# EAGLE design DisplayStick (EAGLE 7.4.0)
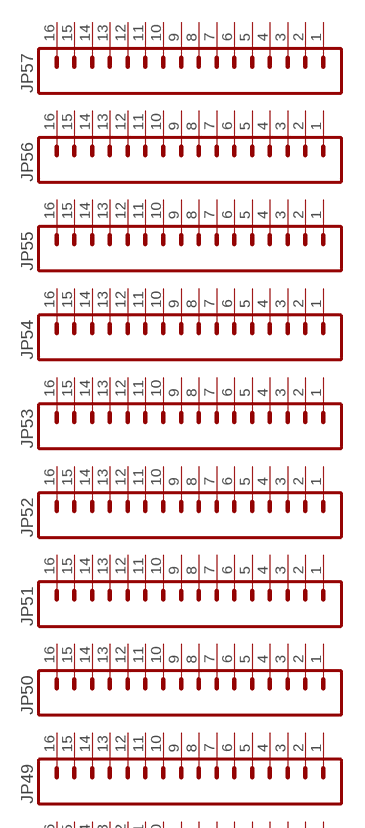
[diagram p0: schematic, sheet 1, part 1 of 2]
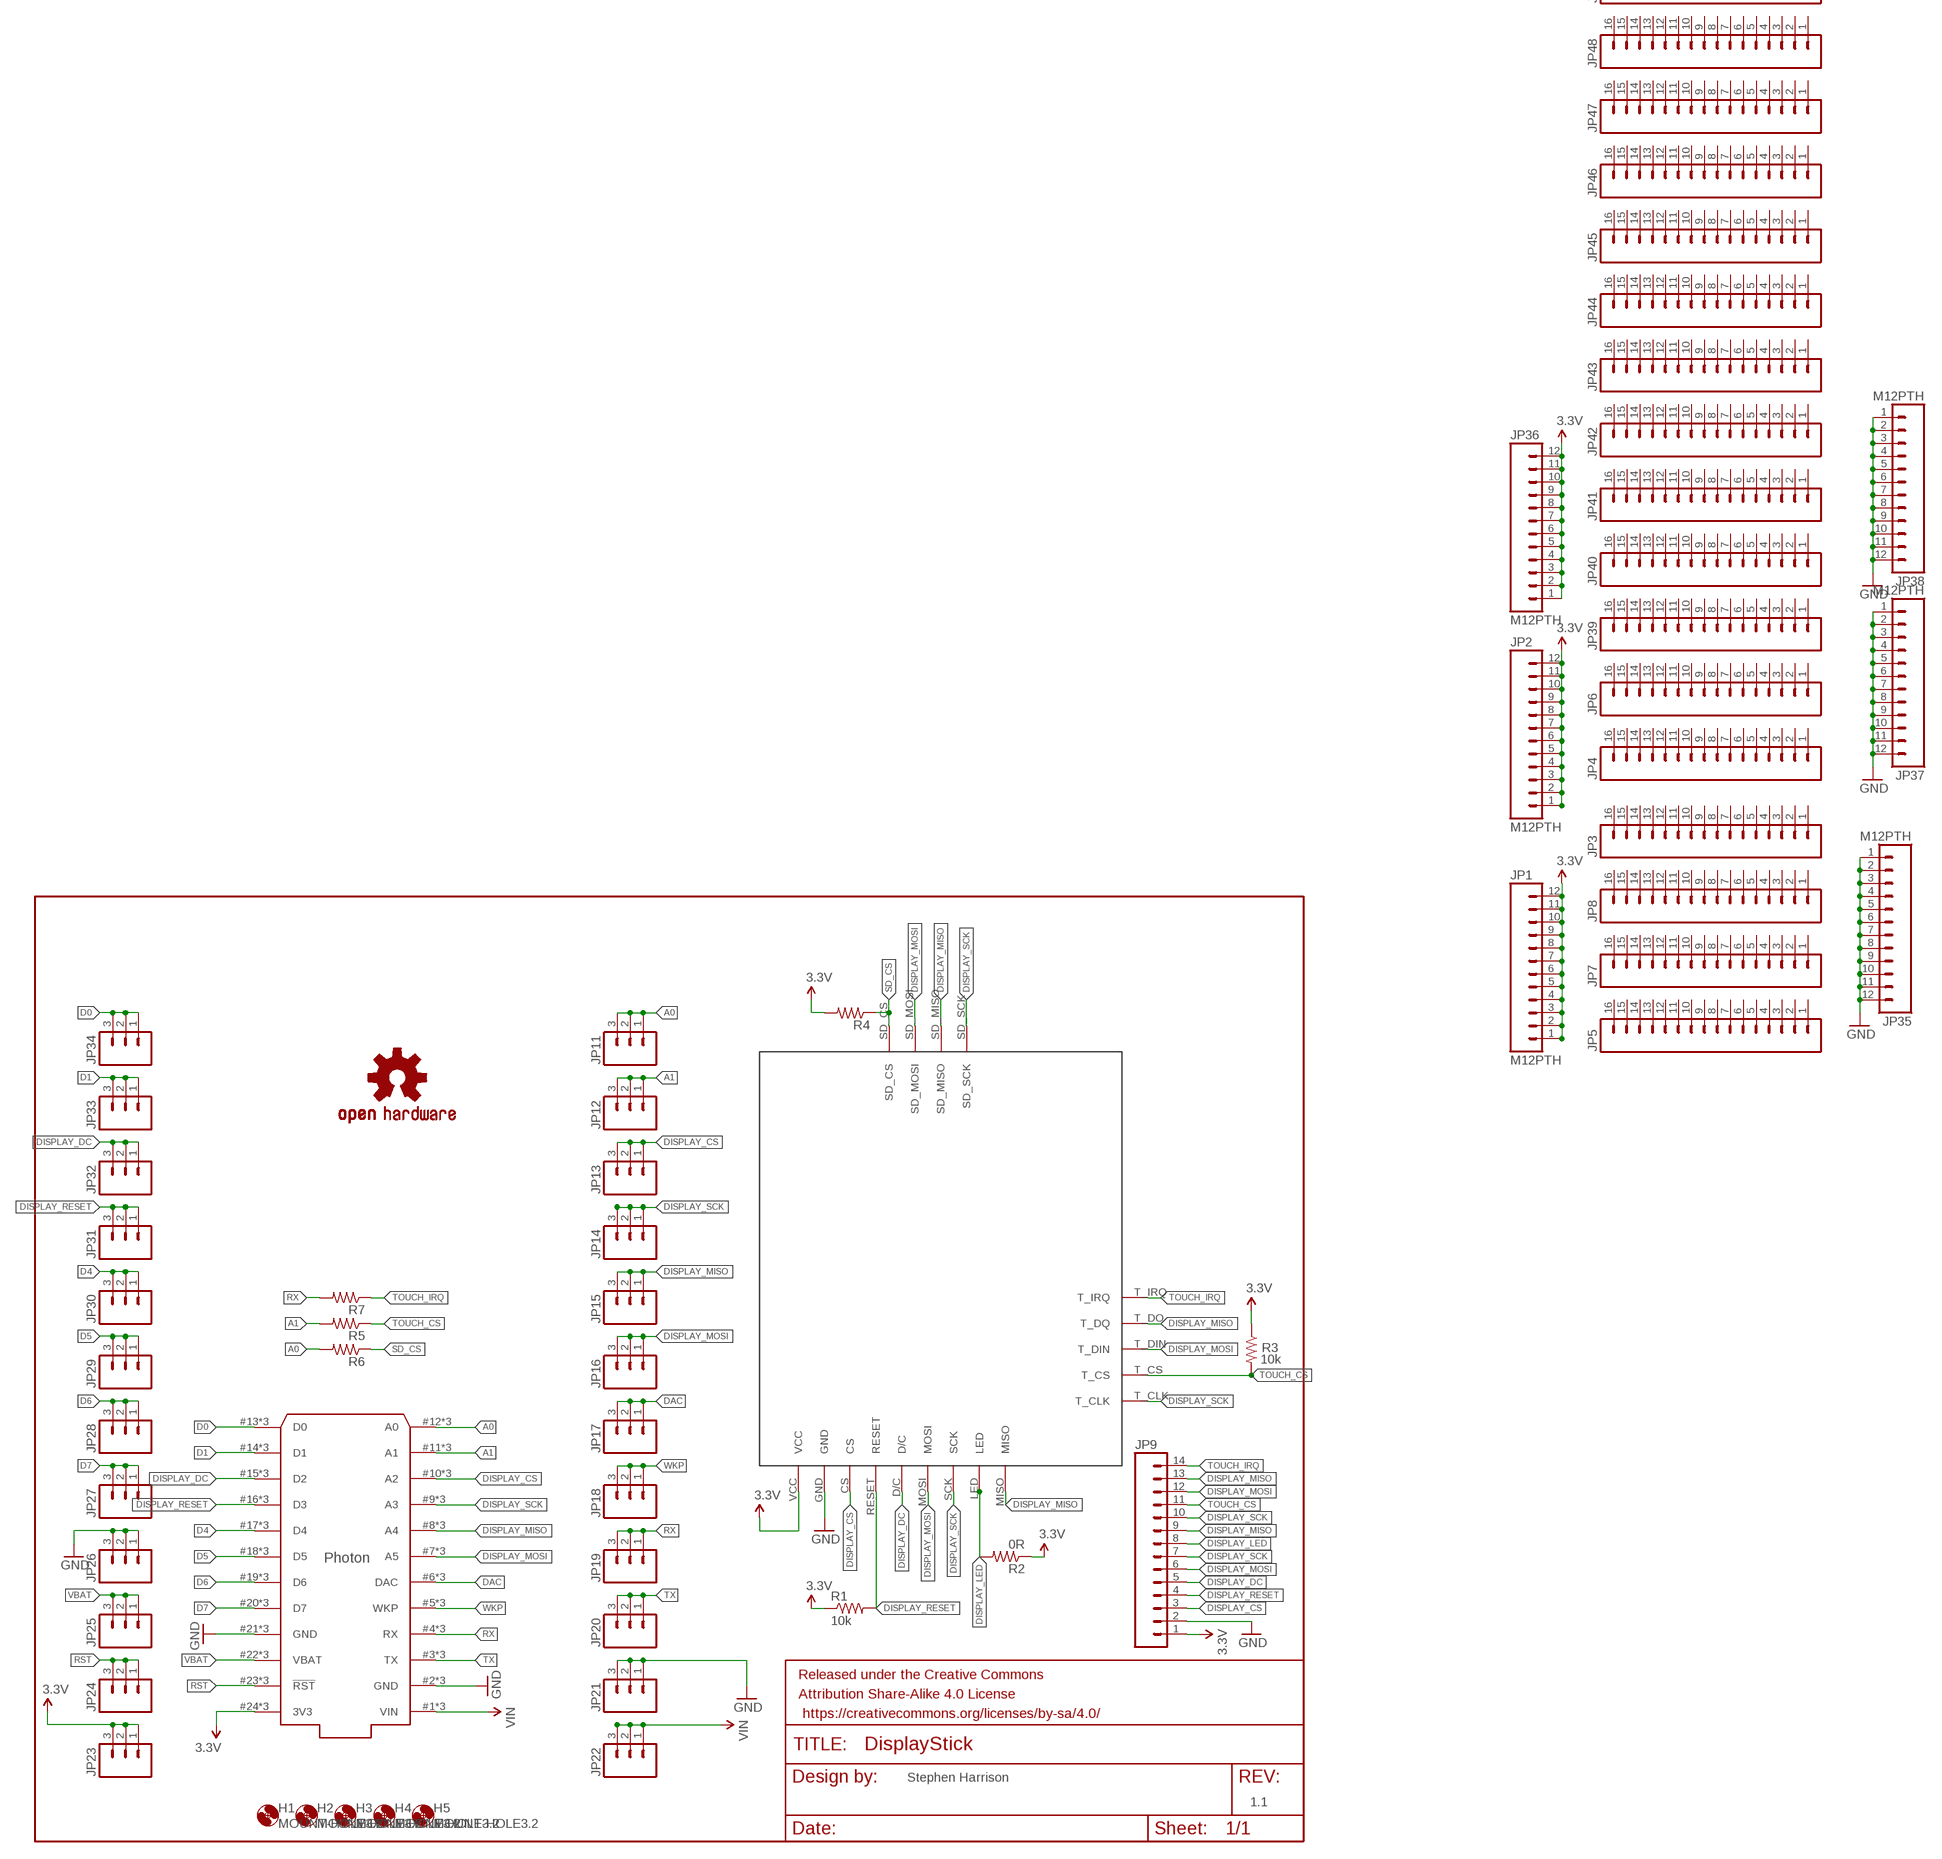
[diagram p1: schematic, sheet 1, part 2 of 2]

## Parts
FRAME1  FRAME-LETTER  [CREATIVE_COMMONS]
H1  MOUNT-HOLE3.2  [3,2]
H2  MOUNT-HOLE3.2  [3,2]
H3  MOUNT-HOLE3.2  [3,2]
H4  MOUNT-HOLE3.2  [3,2]
H5  MOUNT-HOLE3.2  [3,2]
JP1  M12PTH  [1X12-SMALL-PADS]
JP2  M12PTH  [1X12-SMALL-PADS]
JP3  M161X16_NO_SILK  [1X16_NO_SILK]
JP4  M161X16_NO_SILK  [1X16_NO_SILK]
JP5  M161X16_NO_SILK  [1X16_NO_SILK]
JP6  M161X16_NO_SILK  [1X16_NO_SILK]
JP7  M161X16_NO_SILK  [1X16_NO_SILK]
JP8  M161X16_NO_SILK  [1X16_NO_SILK]
JP9  M14  [1X14]
JP11  M03PTH  [1X03]
JP12  M03PTH  [1X03]
JP13  M03PTH  [1X03]
JP14  M03PTH  [1X03]
JP15  M03PTH  [1X03]
JP16  M03PTH  [1X03]
JP17  M03PTH  [1X03]
JP18  M03PTH  [1X03]
JP19  M03PTH  [1X03]
JP20  M03PTH  [1X03]
JP21  M03PTH  [1X03]
JP22  M03PTH  [1X03]
JP23  M03PTH  [1X03]
JP24  M03PTH  [1X03]
JP25  M03PTH  [1X03]
JP26  M03PTH  [1X03]
JP27  M03PTH  [1X03]
JP28  M03PTH  [1X03]
JP29  M03PTH  [1X03]
JP30  M03PTH  [1X03]
JP31  M03PTH  [1X03]
JP32  M03PTH  [1X03]
JP33  M03PTH  [1X03]
JP34  M03PTH  [1X03]
JP35  M12PTH  [1X12-SMALL-PADS]
JP36  M12PTH  [1X12-SMALL-PADS]
JP37  M12PTH  [1X12-SMALL-PADS]
JP38  M12PTH  [1X12-SMALL-PADS]
JP39  M161X16_NO_SILK  [1X16_NO_SILK]
JP40  M161X16_NO_SILK  [1X16_NO_SILK]
JP41  M161X16_NO_SILK  [1X16_NO_SILK]
JP42  M161X16_NO_SILK  [1X16_NO_SILK]
JP43  M161X16_NO_SILK  [1X16_NO_SILK]
JP44  M161X16_NO_SILK  [1X16_NO_SILK]
JP45  M161X16_NO_SILK  [1X16_NO_SILK]
JP46  M161X16_NO_SILK  [1X16_NO_SILK]
JP47  M161X16_NO_SILK  [1X16_NO_SILK]
JP48  M161X16_NO_SILK  [1X16_NO_SILK]
JP49  M161X16_NO_SILK  [1X16_NO_SILK]
JP50  M161X16_NO_SILK  [1X16_NO_SILK]
JP51  M161X16_NO_SILK  [1X16_NO_SILK]
JP52  M161X16_NO_SILK  [1X16_NO_SILK]
JP53  M161X16_NO_SILK  [1X16_NO_SILK]
JP54  M161X16_NO_SILK  [1X16_NO_SILK]
JP55  M161X16_NO_SILK  [1X16_NO_SILK]
JP56  M161X16_NO_SILK  [1X16_NO_SILK]
JP57  M161X16_NO_SILK  [1X16_NO_SILK]
LOGO1  OSHW-LOGOL  [OSHW-LOGO-L]
R1  10k  RESISTOR1206  [1206]
R2  0R  RESISTOR1206  [1206]
R3  10k  RESISTOR1206  [1206]
R4  RESISTOR1206  [1206]
R5  RESISTOR1206  [1206]
R6  RESISTOR1206  [1206]
R7  RESISTOR1206  [1206]
U$1  TJCTM240  [TJCTM240]
U$3  PHOTON_WITH_STACKABLE_HEADERS  [PHOTON_STACKABLE]

## Nets
3.3V: JP1.1 JP1.2 JP1.3 JP1.4 JP1.5 JP1.6 JP1.7 JP1.8 JP1.9 JP1.10 JP1.11 JP1.12 JP2.1 JP2.2 JP2.3 JP2.4 JP2.5 JP2.6 JP2.7 JP2.8 JP2.9 JP2.10 JP2.11 JP2.12 JP9.1 JP23.1 JP23.2 JP23.3 JP36.1 JP36.2 JP36.3 JP36.4 JP36.5 JP36.6 JP36.7 JP36.8 JP36.9 JP36.10 JP36.11 JP36.12 R1.1 R2.1 R3.1 R4.2 U$1.VCC U$3.24(3V3) U$3.#24(3V3) U$3.@24(3V3)
A0: JP11.1 JP11.2 JP11.3 R6.2 U$3.12(A0) U$3.#12(A0) U$3.@12(A0)
A1: JP12.1 JP12.2 JP12.3 R5.2 U$3.11(A1) U$3.#11(A1) U$3.@11(A1)
D0: JP34.1 JP34.2 JP34.3 U$3.13(D0) U$3.#13(D0) U$3.@13(D0)
D1: JP33.1 JP33.2 JP33.3 U$3.14(D1) U$3.#14(D1) U$3.@14(D1)
D4: JP30.1 JP30.2 JP30.3 U$3.17(D4) U$3.#17(D4) U$3.@17(D4)
D5: JP29.1 JP29.2 JP29.3 U$3.18(D5) U$3.#18(D5) U$3.@18(D5)
D6: JP28.1 JP28.2 JP28.3 U$3.19(D6) U$3.#19(D6) U$3.@19(D6)
D7: JP27.1 JP27.2 JP27.3 U$3.20(D7) U$3.#20(D7) U$3.@20(D7)
DAC: JP17.1 JP17.2 JP17.3 U$3.6(DAC) U$3.#6(DAC) U$3.@6(DAC)
DISPLAY_CS: JP9.3 JP13.1 JP13.2 JP13.3 U$1.CS U$3.10(A2) U$3.#10(A2) U$3.@10(A2)
DISPLAY_DC: JP9.5 JP32.1 JP32.2 JP32.3 U$1.D/C U$3.15(D2) U$3.#15(D2) U$3.@15(D2)
DISPLAY_LED: JP9.8 R2.2 U$1.LED
DISPLAY_MISO: JP9.9 JP9.13 JP15.1 JP15.2 JP15.3 U$1.MISO U$1.SD_MISO U$1.T_DO(T_DQ) U$3.8(A4) U$3.#8(A4) U$3.@8(A4)
DISPLAY_MOSI: JP9.6 JP9.12 JP16.1 JP16.2 JP16.3 U$1.MOSI U$1.SD_MOSI U$1.T_DIN U$3.7(A5) U$3.#7(A5) U$3.@7(A5)
DISPLAY_RESET: JP9.4 JP31.1 JP31.2 JP31.3 R1.2 U$1.RESET U$3.16(D3) U$3.#16(D3) U$3.@16(D3)
DISPLAY_SCK: JP9.7 JP9.10 JP14.1 JP14.2 JP14.3 U$1.SCK U$1.SD_SCK U$1.T_CLK U$3.9(A3) U$3.#9(A3) U$3.@9(A3)
GND: JP9.2 JP21.1 JP21.2 JP21.3 JP26.1 JP26.2 JP26.3 JP35.1 JP35.2 JP35.3 JP35.4 JP35.5 JP35.6 JP35.7 JP35.8 JP35.9 JP35.10 JP35.11 JP35.12 JP37.1 JP37.2 JP37.3 JP37.4 JP37.5 JP37.6 JP37.7 JP37.8 JP37.9 JP37.10 JP37.11 JP37.12 JP38.1 JP38.2 JP38.3 JP38.4 JP38.5 JP38.6 JP38.7 JP38.8 JP38.9 JP38.10 JP38.11 JP38.12 U$1.GND U$3.2(GND) U$3.21(GND) U$3.#2(GND) U$3.#21(GND) U$3.@2(GND) U$3.@21(GND)
RST: JP24.1 JP24.2 JP24.3 U$3.23(!RST) U$3.#23(!RST) U$3.@23(!RST)
RX: JP19.1 JP19.2 JP19.3 R7.2 U$3.4(RX) U$3.#4(RX) U$3.@4(RX)
SD_CS: R4.1 R6.1 U$1.SD_CS
TOUCH_CS: JP9.11 R3.2 R5.1 U$1.T_CS
TOUCH_IRQ: JP9.14 R7.1 U$1.T_IRQ
TX: JP20.1 JP20.2 JP20.3 U$3.3(TX) U$3.#3(TX) U$3.@3(TX)
VBAT: JP25.1 JP25.2 JP25.3 U$3.22(VBAT) U$3.#22(VBAT) U$3.@22(VBAT)
VIN: JP22.1 JP22.2 JP22.3 U$3.1(VIN) U$3.#1(VIN) U$3.@1(VIN)
WKP: JP18.1 JP18.2 JP18.3 U$3.5(WKP) U$3.#5(WKP) U$3.@5(WKP)
Unconnected: JP3.1 JP3.2 JP3.3 JP3.4 JP3.5 JP3.6 JP3.7 JP3.8 JP3.9 JP3.10 JP3.11 JP3.12 JP3.13 JP3.14 JP3.15 JP3.16 JP4.1 JP4.2 JP4.3 JP4.4 JP4.5 JP4.6 JP4.7 JP4.8 JP4.9 JP4.10 JP4.11 JP4.12 JP4.13 JP4.14 JP4.15 JP4.16 JP5.1 JP5.2 JP5.3 JP5.4 JP5.5 JP5.6 JP5.7 JP5.8 JP5.9 JP5.10 JP5.11 JP5.12 JP5.13 JP5.14 JP5.15 JP5.16 JP6.1 JP6.2 JP6.3 JP6.4 JP6.5 JP6.6 JP6.7 JP6.8 JP6.9 JP6.10 JP6.11 JP6.12 JP6.13 JP6.14 JP6.15 JP6.16 JP7.1 JP7.2 JP7.3 JP7.4 JP7.5 JP7.6 JP7.7 JP7.8 JP7.9 JP7.10 JP7.11 JP7.12 JP7.13 JP7.14 JP7.15 JP7.16 JP8.1 JP8.2 JP8.3 JP8.4 JP8.5 JP8.6 JP8.7 JP8.8 JP8.9 JP8.10 JP8.11 JP8.12 JP8.13 JP8.14 JP8.15 JP8.16 JP39.1 JP39.2 JP39.3 JP39.4 JP39.5 JP39.6 JP39.7 JP39.8 JP39.9 JP39.10 JP39.11 JP39.12 JP39.13 JP39.14 JP39.15 JP39.16 JP40.1 JP40.2 JP40.3 JP40.4 JP40.5 JP40.6 JP40.7 JP40.8 JP40.9 JP40.10 JP40.11 JP40.12 JP40.13 JP40.14 JP40.15 JP40.16 JP41.1 JP41.2 JP41.3 JP41.4 JP41.5 JP41.6 JP41.7 JP41.8 JP41.9 JP41.10 JP41.11 JP41.12 JP41.13 JP41.14 JP41.15 JP41.16 JP42.1 JP42.2 JP42.3 JP42.4 JP42.5 JP42.6 JP42.7 JP42.8 JP42.9 JP42.10 JP42.11 JP42.12 JP42.13 JP42.14 JP42.15 JP42.16 JP43.1 JP43.2 JP43.3 JP43.4 JP43.5 JP43.6 JP43.7 JP43.8 JP43.9 JP43.10 JP43.11 JP43.12 JP43.13 JP43.14 JP43.15 JP43.16 JP44.1 JP44.2 JP44.3 JP44.4 JP44.5 JP44.6 JP44.7 JP44.8 JP44.9 JP44.10 JP44.11 JP44.12 JP44.13 JP44.14 JP44.15 JP44.16 JP45.1 JP45.2 JP45.3 JP45.4 JP45.5 JP45.6 JP45.7 JP45.8 JP45.9 JP45.10 JP45.11 JP45.12 JP45.13 JP45.14 JP45.15 JP45.16 JP46.1 JP46.2 JP46.3 JP46.4 JP46.5 JP46.6 JP46.7 JP46.8 JP46.9 JP46.10 JP46.11 JP46.12 JP46.13 JP46.14 JP46.15 JP46.16 JP47.1 JP47.2 JP47.3 JP47.4 JP47.5 JP47.6 JP47.7 JP47.8 JP47.9 JP47.10 JP47.11 JP47.12 JP47.13 JP47.14 JP47.15 JP47.16 JP48.1 JP48.2 JP48.3 JP48.4 JP48.5 JP48.6 JP48.7 JP48.8 JP48.9 JP48.10 JP48.11 JP48.12 JP48.13 JP48.14 JP48.15 JP48.16 JP49.1 JP49.2 JP49.3 JP49.4 JP49.5 JP49.6 JP49.7 JP49.8 JP49.9 JP49.10 JP49.11 JP49.12 JP49.13 JP49.14 JP49.15 JP49.16 JP50.1 JP50.2 JP50.3 JP50.4 JP50.5 JP50.6 JP50.7 JP50.8 JP50.9 JP50.10 JP50.11 JP50.12 JP50.13 JP50.14 JP50.15 JP50.16 JP51.1 JP51.2 JP51.3 JP51.4 JP51.5 JP51.6 JP51.7 JP51.8 JP51.9 JP51.10 JP51.11 JP51.12 JP51.13 JP51.14 JP51.15 JP51.16 JP52.1 JP52.2 JP52.3 JP52.4 JP52.5 JP52.6 JP52.7 JP52.8 JP52.9 JP52.10 JP52.11 JP52.12 JP52.13 JP52.14 JP52.15 JP52.16 JP53.1 JP53.2 JP53.3 JP53.4 JP53.5 JP53.6 JP53.7 JP53.8 JP53.9 JP53.10 JP53.11 JP53.12 JP53.13 JP53.14 JP53.15 JP53.16 JP54.1 JP54.2 JP54.3 JP54.4 JP54.5 JP54.6 JP54.7 JP54.8 JP54.9 JP54.10 JP54.11 JP54.12 JP54.13 JP54.14 JP54.15 JP54.16 JP55.1 JP55.2 JP55.3 JP55.4 JP55.5 JP55.6 JP55.7 JP55.8 JP55.9 JP55.10 JP55.11 JP55.12 JP55.13 JP55.14 JP55.15 JP55.16 JP56.1 JP56.2 JP56.3 JP56.4 JP56.5 JP56.6 JP56.7 JP56.8 JP56.9 JP56.10 JP56.11 JP56.12 JP56.13 JP56.14 JP56.15 JP56.16 JP57.1 JP57.2 JP57.3 JP57.4 JP57.5 JP57.6 JP57.7 JP57.8 JP57.9 JP57.10 JP57.11 JP57.12 JP57.13 JP57.14 JP57.15 JP57.16

## Notes on the sheet
- Stephen Harrison
- 1.1

## Library data of the parts
FRAME1 = SparkFun-Aesthetics:FRAME-LETTER: Schematic Frame Standard 8.5x11 US Letter frame
H1-H5 = holes:MOUNT-HOLE: MOUNTING HOLE with drill center marker
JP1 JP2 JP35-JP38 = Particle:M12: Header 12 Standard 12-pin 0.1" header. Use with straight break away headers (SKU : PRT-00116), right angle break away headers (PRT-00553), swiss pins (PRT-00743), machine pins (PRT-00117), and female headers (PRT-00115).
JP3-JP8 JP39-JP57 = SparkFun-Connectors:M16: 1x16 .1" header
JP9 = SparkFun-Connectors:M14: Header 14 Standard 14-pin 0.1" header. Use with straight break away headers (SKU : PRT-00116), right angle break away headers (PRT-00553), swiss pins (PRT-00743), machine pins (PRT-00117), and female headers (PRT-00115).
JP11-JP34 = SparkFun-Connectors:M03: Header 3 Standard 3-pin 0.1" header. Use with straight break away headers (SKU : PRT-00116), right angle break away headers (PRT-00553), swiss pins (PRT-00743), machine pins (PRT-00117), and female headers (PRT-00115). Molex polarized connector foot print use with SKU : PRT-08232 with associated crimp pins and housings.
LOGO1 = Spark:OSHW-LOGO: Open Source Hardware Logo This logo indicates the piece of hardware it is found on incorporates a OSHW license and/or adheres to the definition of open source hardware found here: http://freedomdefined.org/OSHW
R1-R7 = SparkFun-Resistors:RESISTOR: Resistor Basic schematic elements and footprints for 0603, 1206, and PTH resistors.
U$1 = 2.8InchTFT:TJCTM240: 2.8 tft spi 240*320 V1.1
U$3 = Particle:PHOTON

## Board
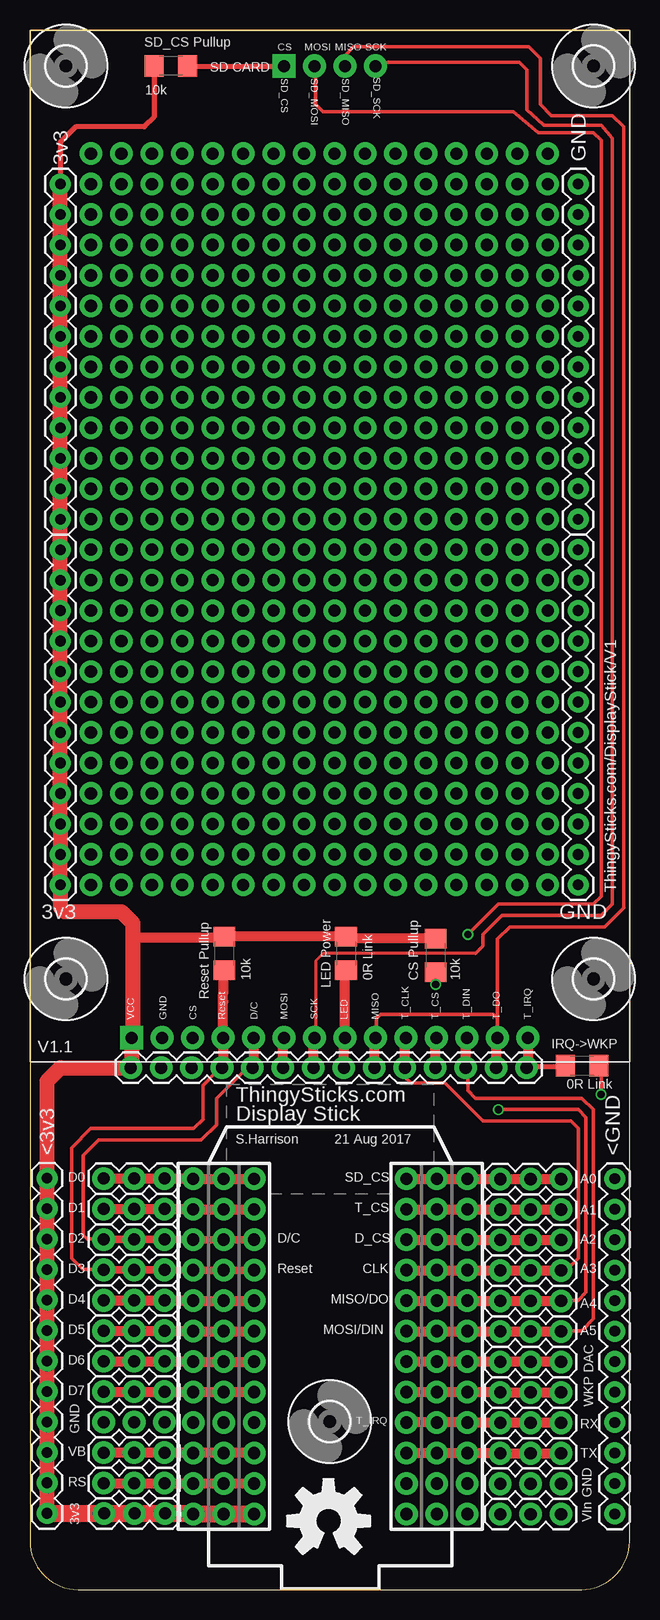
[diagram p2: board, top side]
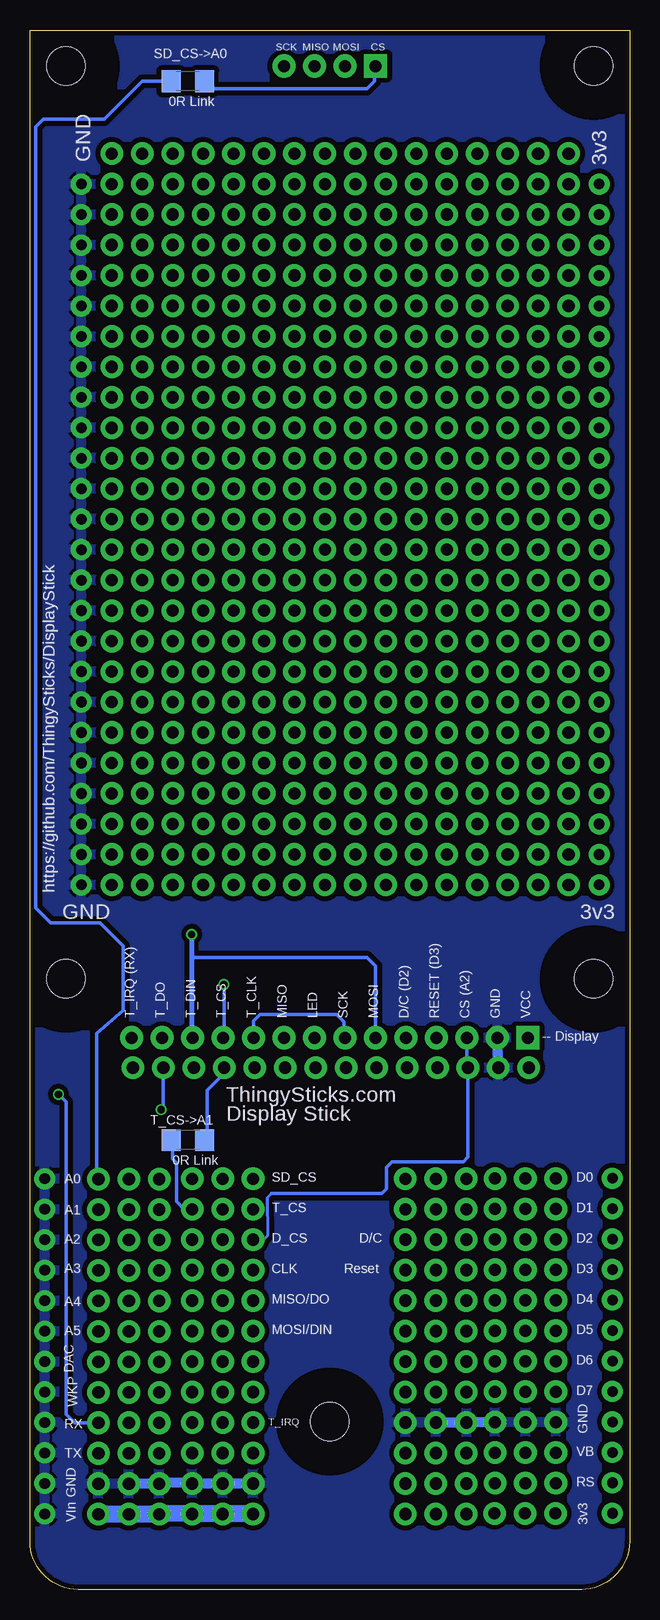
[diagram p3: board, bottom side, seen from below]

Size 50 x 130 mm. Coordinates in mm from the lower left corner, seen from the top.
Outline: 4,0 46,0 arc90 50,4 50,130 0,130 0,4 arc90 4,0
Copper layers (1*16): Top 0.035mm / dielectric 1.5mm / Bottom 0.035mm
Design rules "dirt_cheap_dirty_boards.v1": minimum track width 5mil, minimum drill 12mil, track to track 5mil, track to pad 5mil, pad to pad 5mil, via to via 5mil, smd to smd 0mil, copper to edge 10mil, drill to drill 10mil, minimum pad ring 10mil, minimum via ring 6mil, stop-mask expansion 2mil, vias tented up to drill 25mil, thermal gap 10mil
tRestrict: area 16.6,33 to 33.9,42.1
bRestrict: area 16.6,33 to 33.9,42.1

### Footprints (pad centres in the part's own frame; a part is rotated, then mirrored left to right if it is on the bottom)
3,2 = hole 3.2: 0,0
1X12-SMALL-PADS = drill 0.889 pad 1.753: 1 0,0; 2 2.54,0; 3 5.08,0; 4 7.62,0; 5 10.16,0; 6 12.7,0; 7 15.24,0; 8 17.78,0; 9 20.32,0; 10 22.86,0; 11 25.4,0; 12 27.94,0
1X16_NO_SILK = drill 1.016 pad 1.88: 1 0,0; 2 2.54,0; 3 5.08,0; 4 7.62,0; 5 10.16,0; 6 12.7,0; 7 15.24,0; 8 17.78,0; 9 20.32,0; 10 22.86,0; 11 25.4,0; 12 27.94,0; 13 30.48,0; 14 33.02,0; 15 35.56,0; 16 38.1,0
1X14 = drill 1.016 pad 1.88: 1 0,0; 2 2.54,0; 3 5.08,0; 4 7.62,0; 5 10.16,0; 6 12.7,0; 7 15.24,0; 8 17.78,0; 9 20.32,0; 10 22.86,0; 11 25.4,0; 12 27.94,0; 13 30.48,0; 14 33.02,0
1X03 = drill 1.016 pad 1.88: 1 0,0; 2 2.54,0; 3 5.08,0
1206 = smd 1.6 x 1.8: 1 -1.4,0; 2 1.4,0
TJCTM240 = drill 1 pad 1.93: CS 13.57,2; D/C 18.65,2; GND 11.03,2; LED 26.27,2; MISO 28.81,2; MOSI 21.19,2; RESET 16.11,2; SCK 23.73,2; SD_MISO 26.27,83; SD_MOSI 23.73,83; SD_SCK 28.81,83; T_CLK 31.35,2; T_CS 33.89,2; T_DIN 36.43,2; T_DO 38.97,2; T_IRQ 41.51,2 | drill 1 pad 1.93 square: SD_CS 21.19,83; VCC 8.49,2 | hole 3.2: 3,6.92; 47,6.92; 3,83; 47,83
PHOTON_STACKABLE = drill 1.016 pad 1.88: 1 1.27,32.258; 2 1.27,29.718; 3 1.27,27.178; 4 1.27,24.638; 5 1.27,22.098; 6 1.27,19.558; 7 1.27,17.018; 8 1.27,14.478; 9 1.27,11.938; 10 1.27,9.398; 11 1.27,6.858; 12 1.27,4.318; 13 19.05,4.318; 14 19.05,6.858; 15 19.05,9.398; 16 19.05,11.938; 17 19.05,14.478; 18 19.05,17.018; 19 19.05,19.558; 20 19.05,22.098; 21 19.05,24.638; 22 19.05,27.178; 23 19.05,29.718; 24 19.05,32.258; #1 3.81,32.258; #2 3.81,29.718; #3 3.81,27.178; #4 3.81,24.638; #5 3.81,22.098; #6 3.81,19.558; #7 3.81,17.018; #8 3.81,14.478; #9 3.81,11.938; #10 3.81,9.398; #11 3.81,6.858; #12 3.81,4.318; #13 21.59,4.318; #14 21.59,6.858; #15 21.59,9.398; #16 21.59,11.938; #17 21.59,14.478; #18 21.59,17.018; #19 21.59,19.558; #20 21.59,22.098; #21 21.59,24.638; #22 21.59,27.178; #23 21.59,29.718; #24 21.59,32.258; @1 -1.27,32.258; @2 -1.27,29.718; @3 -1.27,27.178; @4 -1.27,24.638; @5 -1.27,22.098; @6 -1.27,19.558; @7 -1.27,17.018; @8 -1.27,14.478; @9 -1.27,11.938; @10 -1.27,9.398; @11 -1.27,6.858; @12 -1.27,4.318; @13 16.51,4.318; @14 16.51,6.858; @15 16.51,9.398; @16 16.51,11.938; @17 16.51,14.478; @18 16.51,17.018; @19 16.51,19.558; @20 16.51,22.098; @21 16.51,24.638; @22 16.51,27.178; @23 16.51,29.718; @24 16.51,32.258

### Placement (x,y rotation side)
FRAME1  -5.71,-21.27 0 top  (outside the outline)
H1  25,14 0 top
H2  3,127 0 top
H3  47,127 0 top
H4  3,50.9 0 top
H5  47,50.9 0 top
JP1  1.42,6.35 90 top
JP2  2.54,58.74 90 top
JP3  5.08,66.36 0 top
JP4  5.08,68.9 0 top
JP5  5.08,58.74 0 top
JP6  5.08,71.44 0 top
JP7  5.08,61.28 0 top
JP8  5.08,63.82 0 top
JP9  8.4,43.5 0 top
JP11  39.22,34.21 0 top
JP12  39.22,31.67 0 top
JP13  39.22,29.13 0 top
JP14  39.22,26.59 0 top
JP15  39.22,24.05 0 top
JP16  39.22,21.51 0 top
JP17  39.22,18.97 0 top
JP18  39.22,16.43 0 top
JP19  39.22,13.89 0 top
JP20  39.22,11.35 0 top
JP21  39.22,8.81 0 top
JP22  39.22,6.27 0 top
JP23  6.18,6.35 0 top
JP24  6.15,8.86 0 top
JP25  6.15,11.4 0 top
JP26  6.15,13.94 0 top
JP27  6.15,16.48 0 top
JP28  6.15,19.02 0 top
JP29  6.15,21.56 0 top
JP30  6.15,24.1 0 top
JP31  6.15,26.64 0 top
JP32  6.15,29.18 0 top
JP33  6.15,31.72 0 top
JP34  6.15,34.26 0 top
JP35  48.77,6.3 90 top
JP36  2.54,89.22 90 top
JP37  45.72,58.74 90 top
JP38  45.72,89.22 90 top
JP39  5.08,73.98 0 top
JP40  5.08,76.52 0 top
JP41  5.08,79.06 0 top
JP42  5.08,81.6 0 top
JP43  5.08,84.14 0 top
JP44  5.08,86.68 0 top
JP45  5.08,89.22 0 top
JP46  5.08,91.76 0 top
JP47  5.08,94.3 0 top
JP48  5.08,96.84 0 top
JP49  5.08,99.38 0 top
JP50  5.08,101.92 0 top
JP51  5.08,104.46 0 top
JP52  5.08,107 0 top
JP53  5.08,109.54 0 top
JP54  5.08,112.08 0 top
JP55  5.08,114.62 0 top
JP56  5.08,117.16 0 top
JP57  5.08,119.7 0 top
LOGO1  24.9,5.71 0 top
R1  16.19,53.02 270 top
R2  26.35,53.02 270 top
R3  33.82,52.86 270 top
R4  11.75,127 180 top
R5  36.83,37.47 180 bottom
R6  36.83,125.73 180 bottom
R7  46.04,43.68 0 top
U$1  0,44 0 top
U$3  35.2,38.56 180 top

### Tracks (layer width: path | path; a pad name or v marks a point on that pad's centre or on a via)
3.3V
  Top 0.406: 26.5,54.26 R2.1 | JP36.12 2.54,120.65 3.81,121.92 9.53,121.92 10.35,122.74 R4.2
  Top 0.813: 8.49,43.59 JP9.1 | R3.1 26.5,54.26 | R2.1 R1.1 16.06,54.29 8.57,54.29
  Top 1.27: 8.49,43.59 U$1.VCC 8.57,46.08 8.57,54.29 8.57,55.56 7.62,56.52 2.86,56.52 2.54,56.83 JP2.1 JP2.2 JP2.3 JP2.4 JP2.5 JP2.6 JP2.7 JP2.8 JP2.9 JP2.10 JP2.11 JP2.12 JP36.1 JP36.2 JP36.3 JP36.4 JP36.5 JP36.6 JP36.7 JP36.8 JP36.9 JP36.10 JP36.11 JP36.12 | JP1.1 JP1.2 JP1.3 JP1.4 JP1.5 JP1.6 JP1.7 JP1.8 JP1.9 JP1.10 JP1.11 JP1.12 1.42,42.38 2.54,43.5 JP9.1
  Top 1.422: JP1.1 JP23.1 JP23.2 JP23.3 | JP23.3 13.8,6.35 U$3.#24 U$3.24 U$3.@24 | JP23.3 13.97,6.35
A0
  Top 0.813: U$3.#12 U$3.12 U$3.@12 39.19,34.24 JP11.1 JP11.2 JP11.3
  Bottom 0.305: R6.2 40.64,125.73 43.81,122.56 48.9,122.56 49.53,121.92 49.53,56.83 48.26,55.56 44.13,55.56 42.23,53.66 42.23,48.26 44.45,46.35 44.45,34.37 JP11.3
A1
  Top 0.813: U$3.#11 U$3.11 U$3.@11 39.19,31.7 JP12.1 JP12.2 JP12.3
  Bottom 0.305: R5.2 38.23,37.59 38.1,36.83 38.1,35.88 37.78,35.56 37.78,32.33 37.15,31.7 U$3.@11
D0
  Top 0.813: JP34.1 JP34.2 JP34.3 13.59,34.27 U$3.#13 U$3.13 U$3.@13
D1
  Top 0.813: JP33.1 JP33.2 JP33.3 13.59,31.73 U$3.#14 U$3.14 U$3.@14
D4
  Top 0.813: JP30.1 JP30.2 JP30.3 13.59,24.11 U$3.#17 U$3.17 U$3.@17
D5
  Top 0.813: JP29.1 JP29.2 JP29.3 13.59,21.57 U$3.#18 U$3.18 U$3.@18
D6
  Top 0.813: JP28.1 JP28.2 JP28.3 13.59,19.02 U$3.#19 U$3.19 U$3.@19
D7
  Top 0.813: JP27.1 JP27.2 JP27.3 13.59,16.48 U$3.#20 U$3.20 U$3.@20
DAC
  Top 0.813: JP17.3 JP17.2 JP17.1 36.5,18.97 U$3.@6 U$3.6 U$3.#6
DISPLAY_CS
  Top 0.813: U$3.#10 U$3.10 U$3.@10 39.19,29.16 JP13.1 JP13.2 JP13.3
  Bottom 0.254: U$3.#10 30.49,29.2 30.16,29.53 30.17,32.69 29.84,33.02
  Bottom 0.305: 29.84,33.02 20.64,33.02 20.27,33.39 20.27,35.2 19.81,35.66 13.87,35.66 13.48,36.05 JP9.3 | 13.57,43.5 U$1.CS
  Bottom 0.406: JP9.3 13.57,43.5
DISPLAY_DC
  Top 0.305: JP9.5 18.1,43.5 15.56,40.96 15.56,38.73 14.29,37.47 5.71,37.47 4.45,36.2 4.45,29.53 4.76,29.21 6.12,29.21 JP32.1
  Top 0.61: JP32.1 JP32.2 JP32.3 13.79,29.18 U$3.#15 U$3.15 U$3.@15
  Top 0.813: U$1.D/C 18.65,43.59 JP9.5
DISPLAY_LED
  Top 0.813: R2.2 26.27,51.01 U$1.LED 26.18,45.91 JP9.8
DISPLAY_MISO  (via drill 0.6)
  Top 0.254: 28.89,46.08 U$1.MISO
  Top 0.305: v39.05,40.01 45.72,40.01 46.35,39.37 46.35,24.77 45.71,24.12 44.37,24.12 JP15.3 | U$1.SD_MISO 26.27,127.87 26.99,128.59 41.59,128.59 42.55,127.64 42.55,123.83 43.5,122.87 48.58,122.87 49.53,121.92 49.53,56.83 47.94,55.24 40.01,55.24 38.97,54.21 38.97,47.62 | U$1.T_DO 38.97,47.62 | 28.89,46.08 28.89,47.62 29.21,47.94 38.65,47.94 38.97,47.62
  Top 0.813: JP9.9 28.72,45.91 U$1.MISO | U$3.#8 U$3.8 U$3.@8 39.19,24.08 JP15.1 JP15.2 JP15.3 | JP9.13 38.88,45.91 U$1.T_DO
  Bottom 0.305: JP9.13 38.88,40.15 v39.05,40.01
DISPLAY_MOSI  (via drill 0.6)
  Top 0.254: 36.51,45.92 U$1.T_DIN | 20.95,45.77 U$1.MOSI
  Top 0.305: 44.45,21.59 44.77,21.59 44.76,21.58 | v36.51,54.61 39.05,57.15 46.99,57.15 47.62,57.78 47.62,120.8 46.99,121.44 42.39,121.44 40.32,123.19 24.45,123.19 23.81,123.83 23.81,126.92 U$1.SD_MOSI | 44.76,21.58 46.03,21.58 46.99,22.54 46.99,40.01 46.04,40.96 37.15,40.96 36.51,41.59 36.51,43.33 JP9.12 | JP16.3 44.37,21.58 44.76,21.58
  Top 0.813: JP9.12 36.34,45.91 U$1.T_DIN | JP9.6 21.1,45.91 U$1.MOSI | U$3.#7 U$3.7 U$3.@7 39.19,21.54 JP16.1 JP16.2 JP16.3
  Bottom 0.305: U$1.MOSI 21.19,51.99 21.91,52.7 36.51,52.7
  Bottom 0.406: v36.51,54.61 36.51,52.7 36.51,46.08 U$1.T_DIN
DISPLAY_RESET
  Top 0.305: 15.88,43.35 15.56,43.18 14.42,42.04 14.42,39.18 13.65,38.42 5.08,38.42 3.49,36.83 3.49,27.62 4.45,26.67 6.12,26.67 JP31.1
  Top 0.406: 15.88,43.35 JP9.4
  Top 0.61: U$3.@16 U$3.16 U$3.#16 11.24,26.66 | 11.24,26.66 JP31.3 | 11.24,26.66 8.7,26.66 JP31.2 JP31.1
  Top 0.813: R1.2 16.11,49 U$1.RESET 16.11,43.59 JP9.4
DISPLAY_SCK
  Top 0.254: 37.15,53.02 24.45,53.02 23.81,52.39 23.81,46.08 U$1.SCK
  Top 0.305: 28.89,127 29.84,127.32 40.8,127.32 41.44,126.68 41.44,123.34 42.86,122.07 47.62,122.07 48.58,120.97 48.58,57.15 47.62,56.2 39.37,56.2 37.78,54.61 37.78,53.66 37.15,53.02 | JP14.3 44.38,26.68 44.76,26.68 45.72,27.62 45.72,38.42 45.09,39.05 37.78,39.05 34.61,42.23 31.75,42.23 31.11,42.86 31.11,43.35 JP9.10
  Top 0.406: U$1.SD_SCK 28.89,127
  Top 0.813: JP9.7 23.64,45.91 U$1.SCK | JP9.10 31.26,45.91 U$1.T_CLK | U$3.#9 U$3.9 U$3.@9 39.19,26.62 JP14.1 JP14.2 JP14.3
  Bottom 0.305: U$1.T_CLK 31.35,47.39 30.8,47.94 24.45,47.94 23.81,47.31 23.81,46.08 U$1.SCK
GND
  Bottom 0.813: U$1.GND 11.03,43.59 JP9.2 | U$3.@2 U$3.2 U$3.#2 | U$3.21 U$3.#21 13.59,13.95 JP26.3 | JP21.1 JP21.2
  pour Bottom (isolate 0.406, rank 5): 0,130 50.2,130 50.2,0 0,0
N$1
  Bottom 0.813: 36.83,8.89 39.37,8.89
RST
  Top 0.813: JP24.1 JP24.2 JP24.3 13.59,8.87 U$3.#23 U$3.23 U$3.@23
RX  (via drill 0.6)
  Top 0.305: v47.62,41.27 47.62,43.49 R7.2
  Top 0.813: JP19.3 JP19.2 JP19.1 36.5,13.89 U$3.@4 U$3.4 U$3.#4
  Bottom 0.305: JP19.3 46.28,13.89 46.99,14.61 46.99,40.64 v47.62,41.27
SD_CS
  Top 0.406: R4.1 U$1.SD_CS
  Bottom 0.305: R6.1 35.43,125.6 34.92,125.09 21.91,125.09 21.27,125.73 21.27,126.92 U$1.SD_CS
TOUCH_CS  (via drill 0.6)
  Top 0.406: v33.83,50.44 33.97,50.99 R3.2
  Top 0.813: JP9.11 33.8,45.91 U$1.T_CS
  Bottom 0.305: 33.8,48.57 33.8,48.41 33.8,46.09 U$1.T_CS | 33.8,48.57 v33.83,50.44 | 33.8,48.58 33.8,48.57 | JP9.11 33.8,43.03 35.24,41.59 35.24,37.65 R5.1
TOUCH_IRQ
  Top 0.406: 41.51,43.59 44.09,43.59 R7.1
  Top 0.813: U$1.T_IRQ 41.51,43.59 JP9.14
TX
  Top 0.813: U$3.#3 U$3.3 U$3.@3 39.19,11.38 JP20.1 JP20.2 JP20.3
VBAT
  Top 0.813: U$3.@22 U$3.22 U$3.#22 11.25,11.38 JP25.3 JP25.2 JP25.1
VIN
  Bottom 1.422: U$3.#1 U$3.1 U$3.@1 39.15,6.34 JP22.1 JP22.2 JP22.3
WKP
  Top 0.305: 44.32,16.46 JP18.3
  Top 0.813: U$3.#5 U$3.5 U$3.@5 39.19,16.46 JP18.1 JP18.2 JP18.3
  Bottom 0.305: 44.37,16.51 JP18.3

### Text on the board
tNames: SD_CS Pullup | CS | MOSI | MISO | SCK | SD CARD | 10k | 3v3 | GND | ThingySticks.com/DisplayStick/V1 | 3v3 | GND | 10k | 0R Link | CS Pullup | 10k | LED Power | Reset Pullup | V1.1 | IRQ->WKP | 0R Link | ThingySticks.com | Display Stick | S.Harrison | 21 Aug 2017 | <3v3 | <GND | D0 | SD_CS | A0 | D1 | T_CS | A1 | D2 | D/C | D_CS | A2 | D3 | Reset | CLK | A3 | D4 | MISO/DO | A4 | D5 | MOSI/DIN | A5 | D6 | DAC | D7 | WKP | T_IRQ | GND | RX | VB | TX | GND | RS | VIn | 3v3
bNames: CS | MOSI | MISO | SCK | SD_CS->A0 | 0R Link | 3v3 | GND | https://github.com/ThingySticks/DisplayStick | 3v3 | GND | VCC | GND | CS (A2) | RESET (D3) | D/C (D2) | MOSI | SCK | LED | MISO | T_CLK | T_CS | T_DIN | T_DO | T_IRQ (RX) | -- Display | ThingySticks.com | Display Stick | T_CS->A1 | 0R Link | D0 | SD_CS | A0 | D1 | T_CS | A1 | D2 | D/C | D_CS | A2 | D3 | Reset | CLK | A3 | D4 | MISO/DO | A4 | D5 | MOSI/DIN | A5 | D6 | DAC | D7 | WKP | T_IRQ | GND | RX | VB | TX | GND | RS | VIn | 3v3